# Altium schematic sheet LionIRVT-SV601272A-Bias.SchDoc: Bias Supply
size 431 x 279 mm; Date: Not shown in title block; ApprovedBy: Not shown in title block; CheckedBy: Not shown in title block; Author: Not shown in title block; CompanyName: Not shown in title block; Engineer: Not shown in title block; Organization: Not shown in title block; Address1: Not shown in title block; Address2: Not shown in title block; Address3: Not shown in title block; Address4: Not shown in title block; DocumentNumber: 3; Revision: Use project parameter SCH_Rev; SheetNumber: 3; SheetTotal: 11; PageSetup: Record=PageOptions|CenterHorizontal=True|CenterVertical=True|PrintScale=1.00|XCorrection=1.00|YCorrection=1.00|PrintKind=0|BorderSize=5000000|LeftOffset=0|BottomOffset=0|Orientation=2|PaperLength=1000|PaperWidth=1000|Scale=100|PaperSource=15|PrintQuality=600|MediaType=1|DitherType=10|PaperKind=Letter|PrintScaleMode=1; CurrentTime: Not shown in title block; CurrentDate: Not shown in title block; Time: Not shown in title block; DocumentFullPathAndName: Not shown in title block; DocumentName: Not shown in title block; ModifiedDate: Not shown in title block; ImagePath: Not shown in title block
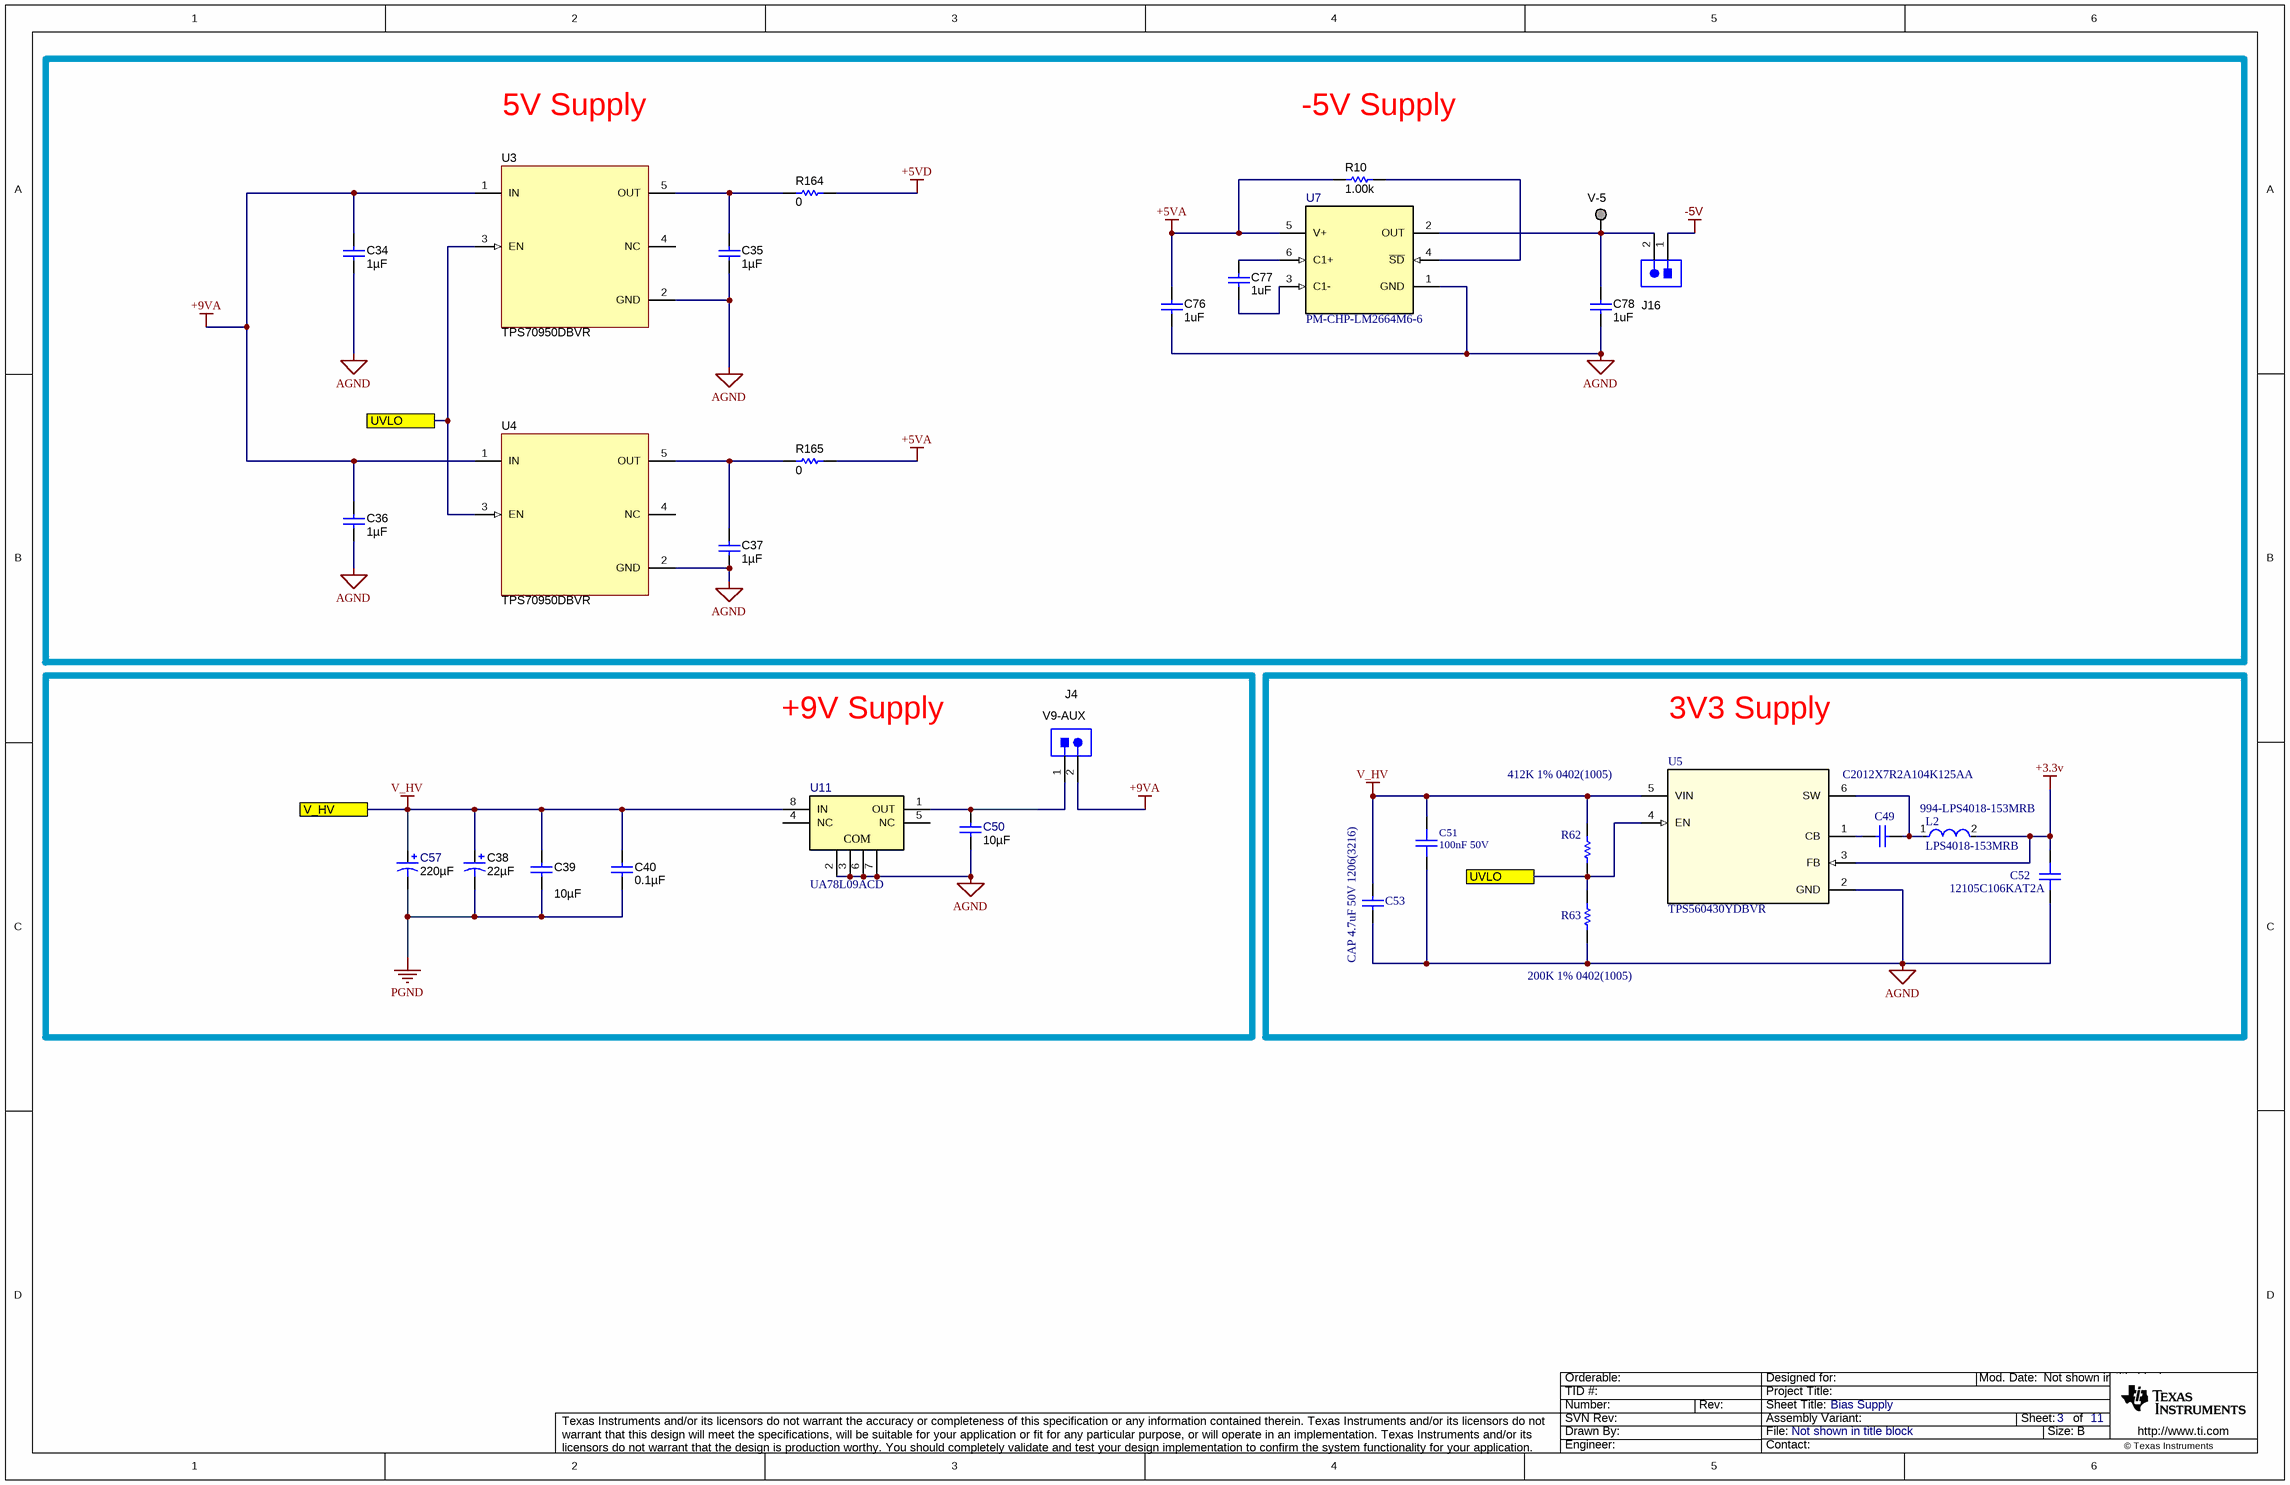
[diagram p0: LionIRVT-SV601272A-Bias.SchDoc]

## Parts
C34  ValueDisplayed: 1µF  [0805_HV]  (hidden comment: C2012X7S2A105K125AB)
C35  ValueDisplayed: 1µF  [0805_HV]  (hidden comment: C2012X7S2A105K125AB)
C36  ValueDisplayed: 1µF  [0805_HV]  (hidden comment: C2012X7S2A105K125AB)
C37  ValueDisplayed: 1µF  [0805_HV]  (hidden comment: C2012X7S2A105K125AB)
C38  ValueDisplayed: 22µF  [CAPSMT_62_JA0]  (hidden comment: EMVH101ADA220MJA0G)
C39  ValueDisplayed: 10µF  [2220_250]  (hidden comment: C5750X7S2A106M230KB)
C40  ValueDisplayed: 0.1µF  [0805_HV]  (hidden comment: C2012X7R2A104K125AA)
C49  C2012X7R2A104K125AA  [CAPC2013X145X20ML20]
C50  ValueDisplayed: 10µF  [0603C]  (hidden comment: GRM188R61E106MA73D)
C51  100nF 50V  [0603C]
C52  12105C106KAT2A  [1210M]
C53  CAP 4.7uF 50V 1206(3216)  [CAPC1206(3216)190_N]
C57  ValueDisplayed: 220µF  [SM_RADIAL_G]  (hidden comment: EEE-FC1E221P)
C76  ValueDisplayed: 1uF  [0805_HV]  (hidden comment: Capacitor)
C77  ValueDisplayed: 1uF  [0805_HV]  (hidden comment: Capacitor)
C78  ValueDisplayed: 1uF  [0805_HV]  (hidden comment: Capacitor)
J4  HTSW-102-07-G-S  [Samtec_HTSW-102-07-G-S]  (value not drawn)
J16  HTSW-102-07-G-S  [Samtec_HTSW-102-07-G-S]  (value not drawn)
L2  LPS4018-153MRB  Supplier Part Number 1: 994-LPS4018-153MRB  [FP-LPS4018-MFG]
R10  ValueDisplayed: 1.00k  [0603R]  (hidden comment: ERJ-3EKF1001V)
R62  412K 1% 0402(1005)  [RESC0402(1005)_L]
R63  200K 1% 0402(1005)  [RESC0402(1005)_L]
R164  value 0  [1206]  (hidden comment: ERJ-8ENF10R0V)
R165  value 0  [1206]  (hidden comment: ERJ-8ENF10R0V)
U3  TPS70950DBVR  [DBV0005A_N]
U4  TPS70950DBVR  [DBV0005A_N]
U5  TPS560430YDBVR  [DBV0006A_N]
U7  PM-CHP-LM2664M6-6  [DBV0006A_M]
U11  UA78L09ACD  [D0008A_N]
V-5  Pogo Pad  [PogoPad]  (value not drawn)  (no BOM)

## Blocks framed on the sheet
V9-AUX: C38-C40 C50 C57 J4 U11

## Ports
UVLO, V_HV

## Nets
+3.3v: C52.2 L2.2 U5.3(FB)
+5VA: C76.1 R10.1 R165.2 U7.5(V+)
+5VD: R164.2
+9VA: C34.1 C36.1 J4.2 U3.1(IN) U4.1(IN)
-5V: J16.1
AGND: C34.2 C35.2 C36.2 C37.2 C50.2 C51.1 C52.1 C53.1 C76.2 C78.2 R63.1 U3.2(GND) U4.2(GND) U5.2(GND) U7.1(GND) U11.2(GND) U11.3(GND) U11.6(GND) U11.7(GND)
PGND: C38.2(-) C39.2 C40.2 C57.2(-)
V_HV: C38.1(+) C39.1 C40.1 C51.2 C53.2 C57.1(+) R62.2 U5.5(VIN) U11.8(IN) ; port V_HV
UVLO: R62.1 R63.2 U3.3(EN) U4.3(EN) U5.4(EN) ; port UVLO
NetC35_1: C35.1 R164.1 U3.5(OUT)
NetC37_1: C37.1 R165.1 U4.5(OUT)
NetC49_1: C49.1 U5.1(CB)
NetC49_2: C49.2 L2.1 U5.6(SW)
NetC50_1: C50.1 J4.1 U11.1(OUT)
NetC77_1: C77.1 U7.6(C1+)
NetC77_2: C77.2 U7.3(C1-)
NetC78_1: C78.1 J16.2 U7.2(OUT) V-5.1
NetR10_2: R10.2 U7.4(~{SD})

Not connected (* = marked no-connect by the designer): U3 4(NC); U4 4(NC); U11 4(NC) 5(NC)

## Notes on the sheet
- 5V Supply
- -5V Supply
- +9V Supply
- 3V3 Supply
- Drawn By:
- SVN Rev:
- Number:
- TID #:
- Orderable:
- Rev:
- Sheet Title:
- File:
- Project Title:
- Designed for:
- Assembly Variant:
- Mod. Date:
- Sheet:
- Size:
- of
- B
- http://www.ti.com
- Texas Instruments and/or its licensors do not warrant the accuracy or completeness of this specification or any information contained therein. Texas Instruments and/or its licensors do not warrant that this design will meet the specifications, will be suitable for your application or fit for any particular purpose, or will operate in an implementation. Texas Instruments and/or its licensors do not warrant that the design is production worthy. You should completely validate and test your design implementation to confirm the system functionality for your application.
- Engineer:
- Contact:
- © Texas Instruments
- (in symbol UA78L09ACD) COM

## Library data of the parts
C34-C37 = C2012X7S2A105K125AB: CAP, CERM, 1 µF, 100 V, +/- 10%, X7S, 0805; Manufacturer: TDK; Polarized: N; CompType: Capacitor; Value: 1uF; U/M: EA; Cap_F: 0.000001; Tolerance_%: 10; Value1: Unknown; VDC_V: 100; Value2: 100V; TaMin_C: -55; TaMax_C: 125; Cap_Case: 0805; AEC Category: Q200; SymbolVersion: 2008-07-09; PartNumber: C2012X7S2A105K125AB; PackageReference: 0805; RoHS: Y; MountType: SMT; Technology: Ceramic; TempCo: X7S; Published: 2008-06-19; Publisher: Texas Instruments; LatestRevisionDate: 2015-12-07; ComponentLink1Description: Datasheet link; ComponentLink1URL: http://product.tdk.com/en/catalog/datasheets/mlcc_commercial_midvoltage_en.pdf; Supplier 1: Digi-Key; Supplier Part Number 1: 445-5205-1-ND; Supplier 2: Mouser; Supplier Part Number 2: 810-C2012X7S2A105K; Supplier 3: Farnell; Supplier Part Number 3: 2112709; AEC Qualified: N; AEC Grade: N/A
C38 = EMVH101ADA220MJA0G: CAP, AL, 22 µF, 100 V, +/- 20%, 0.55 ohm, SMD; Manufacturer: Chemi-Con; Polarized: Y; CompType: Capacitor; Value: 22uF; U/M: EA; Cap_F: 0.000022; Tolerance_%: 20; VDC_V: 100; Value2: 100V; ESR_ohm: 0.55; IRMS_A: 0.115; TaMin_C: -40; TaMax_C: 125; Cap_Case: JA0; SymbolVersion: 2008-07-09; PartNumber: EMVH101ADA220MJA0G; PackageReference: JA0; RoHS: Y; Value1: 0.55 ohm; MountType: SMT; Technology: AL; Series: MVH; Publisher: Texas Instruments; LatestRevisionDate: 2014-11-05; ComponentLink1Description: Datasheet link; ComponentLink1URL: http://www.chemi-con.co.jp/e/catalog/pdf/al-e/al-sepa-e/003-chip/al-mvh-e-111201.pdf; Supplier 1: Digi-Key; Supplier Part Number 1: 565-2341-1-ND; Supplier 2: Mouser; Supplier Part Number 2: 661-MVH100V220M; Supplier 3: Farnell; Supplier Part Number 3: 1698521
C39 = C5750X7S2A106M230KB: CAP, CERM, 10 µF, 100 V, +/- 20%, X7S,; Manufacturer: TDK; Polarized: N; CompType: Capacitor; Value: 10uF; U/M: EA; Cap_F: 0.00001; Tolerance_%: 20; ESR_ohm: 0.005; Value1: 0.005 ohm; VDC_V: 100; Value2: 100V; IRMS_A: 6.45; TaMin_C: -55; TaMax_C: 125; Cap_Case: 2220; SizeArea_mm2: 28.5; SizeAreaWB_mm2: 53.9; SizeX_mm: 5.7; SizeY_mm: 5; SizeZ_mm: 2.5; AEC Category: Q200; SymbolVersion: 2008-07-09; PartNumber: C5750X7S2A106M230KB; RoHS: Y; MountType: SMT; Technology: Ceramic; TempCo: X7S; Published: 2008-06-19; Publisher: Texas Instruments; LatestRevisionDate: 2016-08-21; ComponentLink1Description: Datasheet link; ComponentLink1URL: http://product.tdk.com/en/catalog/datasheets/mlcc_commercial_midvoltage_en.pdf; Supplier 1: Digi-Key; Supplier Part Number 1: 445-5212-1-ND; Supplier 2: Mouser; Supplier Part Number 2: 810-C5750X7S2A106M; Supplier 3: Farnell; Supplier Part Number 3: 2363568; AEC Qualified: N; AEC Grade: N/A
C40 = C2012X7R2A104K125AA: CAP, CERM, 0.1 µF, 100 V, +/- 10%, X7R, 0805; Manufacturer: TDK; Polarized: N; CompType: Capacitor; Value: 0.1uF; U/M: EA; Cap_F: 0.0000001; Tolerance_%: 10; ESR_ohm: 0.0158; Value1: 0.0158 ohm; VDC_V: 100; Value2: 100V; TaMin_C: -55; TaMax_C: 125; Cap_Case: 0805; AEC Category: Q200; SymbolVersion: 2008-07-09; PartNumber: C2012X7R2A104K125AA; PackageReference: 0805; RoHS: Y; MountType: SMT; Technology: Ceramic; TempCo: X7R; Published: 2008-06-19; Publisher: Texas Instruments; LatestRevisionDate: 2015-12-07; ComponentLink1Description: Datasheet link; ComponentLink1URL: http://www.tdk.co.jp/tefe02/e412_c.pdf; Supplier 1: Digi-Key; Supplier Part Number 1: 445-1418-1-ND; Supplier 2: Farnell; Supplier Part Number 2: 1844410; AEC Qualified: N; AEC Grade: N/A
C49 = CMP-2000-05453-1: Chip Capacitor, 100 nF, +/- 10%, 100 V, -55 to 1255 degC, 0805 (2012 Metric), RoHS, Tape and Reel; Manufacturer: TDK; PCN Part Number: MLCCPartNumberChange30/Nov/2012; Temperature Coefficient: X7R; Voltage - Rated: 100V; Kits: SAMPLEKIT1008-ND-KITCAPCERMLCC100V-630V; Other Names: 445-1418-1; Online Catalog: CSeries,MidVoltage; Featured Product: C-SeriesMidVoltageMLCCs; Catalog Drawings: CSERIES_2012-0805_1.45; Product Training Modules: HighCapacitanceReplacementSEAT,CCV,andTVCLDesignToolsGuidetoReplacinganElectrolyticCapacitorwithanMLCC; Capacitance: 0.1µF; Applications: GeneralPurpose; Datasheet Version: Jul-13; Mounting Type: SurfaceMount,MLCC; Height - Seated (Max): -; Packaging: CutTape(CT); Datasheet URL: https://datasheet.ciiva.com/11788/0900766b80fc5cba-11788142.pdf; Tolerance: ±10%; Package Reference: 805; Manufacturer URL: http://www.tdk.com/; Series: C; Lead Style: -; Operating Temperature: -55degC~125degC; Category: Capacitors; Package Description: 2-Pin Surface Mount Device, Body 2 x 1.25 mm; Standard Package: 1; Package / Case: 0805(2012Metric); Family: CeramicCapacitors; RoHS Information: RoHSCertificate-MLCC; Lead Spacing: -; Ratings: -; Features: -
C50 = GRM188R61E106MA73D: CAP, CERM, 10 µF, 25 V,+/- 20%, X5R, 0603; Manufacturer: MuRata; Polarized: N; CompType: Capacitor; Value: 10uF; U/M: EA; Cap_F: 0.00001; Tolerance_%: 20; VDC_V: 25; Value2: 25V; TaMin_C: -55; TaMax_C: 85; Cap_Case: 0603; SizeArea_mm2: 1.28; SizeAreaWB_mm2: 4.68; SizeX_mm: 1.6; SizeY_mm: 0.8; SizeZ_mm: 1; AEC Category: Q200; Green_Lifecycle: Active; Green_REACh: Passed; SymbolVersion: 2008-07-09; PartNumber: GRM188R61E106MA73D; PackageReference: 0603; RoHS: Y; MountType: SMT; Technology: Ceramic; TempCo: X5R; Published: 2008-06-19; Publisher: Texas Instruments; LatestRevisionDate: 2017-06-22; ComponentLink1Description: Datasheet link; ComponentLink1URL: http://psearch.murata.com/capacitor/product/GRM188R61E106MA73%23.pdf; Supplier 1: Digi-Key; Supplier Part Number 1: 490-7202-1-ND; Supplier 2: Mouser; Supplier Part Number 2: 81-GRM188R61E106MA3L; Supplier 3: Farnell; Supplier Part Number 3: 1828803RL; AEC Qualified: ?; Green_EU RoHS: Passed; Green_EU RoHS-2: Incomplete
C51 = gen_C_ceramic_100n_50V_X7R_0603: Ceramic, 100nF, ±10%, 50V, X7R, –55 to 125°C, 0603 (1608),RoHS, Automotive; Part Number: GCJ188R71H104KA12; Manufacturer: Murata; Capacitance: 100n; Case EIA: 0603; Case Metric: 1608; Automotive Qualified: True; PnP Package: C_0603_10; PnP Value: 100nF/50V/X7R; Dielectric: X7R; Rated Voltage: 50V; Height - Seated (Max): 0.8mm; Mounting Type: SurfaceMount,MLCC; Operating Temperature: –55 to 125°C; Series: GCJ; Tolerance: ±10%; Manufacturer_Part_Number: GCJ188R71H104KA12; Supplier 1: Digi-Key; Supplier Part Number 1: 490-5798-1-ND
C52 = gen_C_ceramic_10u_50V_X7R_1210: Ceramic, 10uF, 50 V, -55 to 125 degC, 2-Pin SMD (1210), RoHS, Tape and Reel; Manufacturer: AVX; Manufacturer 1: Kyocera AVX; Dielectric: X7R; Tolerance: ±10%; Load Life: 1000h; Type: CommercialSurfaceMountChip; Voltage Rating: 50V; Temperature Coefficient / Code: +/-15%; Case EIA: 1210; Case Metric: 3225; PnP Package: C_1210_10; PnP Value: 10µF/25V/X7R; Rated Voltage: 25V; Maximum Operating Temperature: +125C; Mounting Technology: SurfaceMount; Case Code - in: 1210; Package Description: 2-Pin Surface Mount Device, Body 3.2 x 2.5 mm; Datasheet URL: http://www.farnell.com/datasheets/1818074.pdf; Case Code - mm: 3225; Package / Case: 1210(3225metric); Product: GeneralTypeMLCCs; Capacitance: 10uF; Product Category: MultilayerCeramicCapacitorsMLCC-SMD/SMT; Minimum Operating Temperature: -55C; Manufacturer URL: http://www.avx.com/; Operating Temperature Range: -55Cto+125C; Termination Style: SMD/SMT; Factory Pack Quantity: 1000; RoHS: Details; Brand: AVX; Datasheet Version: 03/2014; Package Reference: 1210; Packaging: Reel; Voltage Rating DC: 50V; Height - Seated (Max): 2.5mm; Mounting Type: SurfaceMount,MLCC; Operating Temperature: –55 to 125°C; Series: GCM; Manufacturer Part Number 1: 12105C106KAT2A
C53 = CMP-1037-04923-1: CAP 4.7uF 50V ±10% 1206 (3216 Metric) Thickness 1.9mm SMD; Case-EIA: 1206; Case-Metric: 3216; Tolerance: Â±10%; Technology: SMT; Rated Voltage: 50 V; Max Thickness: 1.9 mm; Value: 4.7uF
C57 = EEE-FC1E221P: CAP, AL, 220 µF, 25 V, +/- 20%, 0.15 ohm, SMD; Manufacturer: Panasonic; Polarized: Y; CompType: Capacitor; Value: 220uF; U/M: EA; Cap_F: 0.00022; Tolerance_%: 20; VDC_V: 25; Value2: 25V; ESR_ohm: 0.15; IRMS_A: 0.67; TaMin_C: -40; TaMax_C: 105; Cap_Case: G; SizeAreaWB_mm2: 172.2; SizeArea_mm2: 123.6; SizeX_mm: 12; SizeY_mm: 10.3; SizeZ_mm: 10.2; AEC Category: Q200; SymbolVersion: 2008-07-09; PartNumber: EEE-FC1E221P; PackageReference: SMT Radial G; RoHS: Y; Value1: 0.15 ohm; MountType: SMT; Technology: AL; Series: FC; Publisher: Texas Instruments; LatestRevisionDate: 2017-03-23; ComponentLink1Description: Datasheet link; ComponentLink1URL: http://www.panasonic.com/industrial/components/pdf/smt_aec_050505.pdf; Supplier 1: Digi-Key; Supplier Part Number 1: PCE4005CT-ND; Supplier 2: Mouser; Supplier Part Number 2: 667-EEE-FC1E221P; Supplier 3: Farnell; Supplier Part Number 3: 1244363; AEC Qualified: ?
C76-C78 = CMP-0007891-2: CAP, CERM, 1 uF, 100 V, +/- 10%, X7S, 0805; PartNumber: C2012X7S2A105K125AB; Manufacturer: TDK; Polarized: N; Value: 1uF; U/M: EA; Cap_F: 1µF; ESR_ohm: 8.255m; Value1: 0.008255 ohm; VDC_V: 100V; IRMS_A: 2.27442A; TaMin_C: -55°C; TaMax_C: 125°C; Cap_Case: 0805; AEC Category: Q200; SizeArea_mm2: 2.5; SizeAreaWB_mm2: 6.75; SizeX_mm: 2; SizeY_mm: 1.25; SizeZ_mm: 1.45; CompType: Capacitor; PackageReference: 0805; RoHS: Y; Tolerance_%: 10%; Value2: 100V; MountType: SMT; Technology: Ceramic; TempCo: X7S; Published: 2008-06-19; Publisher: Texas Instruments; LatestRevisionDate: 2017-03-09; ComponentLink1Description: Datasheet link; ComponentLink1URL: https://product.tdk.com/en/search/capacitor/ceramic/mlcc/info?part_no=C2012X7S2A105K125AB; Supplier 1: Digi-Key; Supplier Part Number 1: 445-5205-1-ND; Supplier 2: Newark; Supplier Part Number 2: 90R8332; Supplier 3: Mouser; Supplier Part Number 3: 810-C2012X7S2A105K; AEC Qualified: N; AEC Grade: N/A
J4 J16 = HTSW-102-07-G-S: Header, 100mil, 2x1, Gold, TH; Manufacturer: Samtec; SymbolCreator: a0412235; U/M: EA; SymbolVersion: 2013-10-31; PartNumber: HTSW-102-07-G-S; ClassName: Header; PackageReference: Header, 100mil, 2x1, TH; CompType: Header; RoHS: Y; MountType: TH; ComponentLink1Description: Datasheet Link; ComponentLink1URL: http://www.samtec.com/ftppub/pdf/TSW_TH.PDF; Publisher: Texas Instruments; Supplier 1: Digi-Key; Supplier Part Number 1: SAM8736-ND
  J4: LatestRevisionDate: 2014-12-19
  J16: LatestRevisionDate: 2015-09-29
L2 = CMP-11268-000004-1: Power inductor, shielded, 20/30% tol, SMT, RoHS, lead-free, halogen-free; Manufacturer Part Number: LPS4018-223MRB; Manufacturer: Coilcraft; Inductance: 22uH; Series Resistance: 0.36Ω; Test Frequency: 1MHz; Self Resonant Frequency: 26MHz; Tolerance: 20%; Core Material: Ferrite; Value: 22uH; Automotive Grade: Grade 3; Rms Current: 0.9A; Saturation Current: 0.8A; Shielding: true; DC Resistance (DCR): 260mR; Max DC Current: 940mA; RMS Current (Irms): 800mA; RoHS: TRUE; Device Class L3: Fixed Inductors; Category: Ind; Lead Free: Yes; ComponentLink2URL: https://www.coilcraft.com/pdfs/lps4018.pdf; Height: 1.8mm; Mouser Description: Power inductor, shielded, 20/30% tol, SMT, RoHS, lead-free, halogen-free; Ambient Temperature Range High: +85°C; Ambient Temperature Range Low: -40°C; Device Class L2: Inductors; Package: LPS4018; Device Class L1: Passive Components; Octopart: https://octopart.com/lps4018-223mrb-coilcraft-30061092; ComponentLink2Description: Datasheet; Automotive: Yes; Supplier 1: Mouser; Stock 1: 5661; Pricing 1: 1=1.08000, 10=0.90400, 50=0.89000, 100=0.89000, 200=0.89000, 500=0.61200 (USD); Weight: 0.003527oz; Min Operating Temperature: -40°C; Max Operating Temperature: 85°C; Packaging: Cut Tape; Termination: SMD/SMT; Inductance Tolerance: 20%; Package Quantity: 1; Length: 4mm; Width: 4mm; REACH SVHC: No SVHC; ComponentLink1URL: https://datasheet.ciiva.com/46449/1805324-46449067.pdf?src-supplier=Element14; ComponentLink1Description: https://datasheet.ciiva.com/46449/1805324-46449067.pdf?src-supplier=Element14; ComponentLink3URL: https://datasheet.ciiva.com/46384/1805324-46384172.pdf?src-supplier=Element14; ComponentLink3Description: https://datasheet.ciiva.com/46384/1805324-46384172.pdf?src-supplier=Element14
R10 = CMP-0022680-4: RES, 1.00 k, 1%, 0.1 W, 0603; Manufacturer: Panasonic; Power_W: 100mW; TempCo: 100 ppm/C; Value_Code: 1k00; U/M: EA; Value: 1.00k; EIA_Code: E96; Res_ohm: 1k; SizeX_mm: 1.6; SizeY_mm: 0.8; SizeZ_mm: 1; SizeArea_mm2: 1.28; CompType: Resistor; VDC_V: 75V; AEC Category: Q200; Value2: 0.1W; Supplier Part Number 2: 90W3099; Publisher: Texas Instruments; Supplier 2: Newark; Supplier Part Number 3: 667-ERJ-3EKF1001V; Supplier 3: Mouser; Published: 2008-06-26; RoHS: Y; Value1: 1%; MountType: SMT; Supplier 1: Digi-Key; PackageReference: 0603; Tolerance_%: 1%; LatestRevisionDate: 2017-03-09; PartNumber: ERJ-3EKF1001V; AEC Qualified: ?; ComponentLink1Description: Datasheet link; Supplier Part Number 1: P1.00KHCT-ND; Technology: Thick Film; ComponentLink1URL: http://industrial.panasonic.com/www-data/pdf/AOA0000/AOA0000CE2.pdf
R62 = CMP-1011-00805-1: 412K 0.063W 1% 0402 (1005 Metric)  SMD; Case-EIA: 0402; Case-Metric: 1005; Value: 412000.00 Ohm; Tolerance: 1 %; Technology: SMT; Power: 0.063 W
R63 = CMP-1011-00768-1: 200K 0.063W 1% 0402 (1005 Metric)  SMD; Value: 200000.00 Ohm; Case-Metric: 1005; Case-EIA: 0402; Tolerance: 1 %; Power: 0.063 W; Technology: SMT
R164 R165 = ERJ-8ENF10R0V: RES, 10.0, 1%, 0.25 W, 1206; Manufacturer: Panasonic; CompType: Resistor; Res_ohm: 10; Value_Code: 10R0; Tolerance_%: 1; Power_W: 0.25; Value2: 0.25W; VDC_V: 200; TempCo: 100 ppm/C; EIA_Code: E96; U/M: EA; ValueDisplayed: 10.0; SymbolVersion: 2009-05-29; PartNumber: ERJ-8ENF10R0V; PackageReference: 1206; RoHS: Y; Value1: 1%; MountType: SMT; Technology: Thick Film; Published: 2008-06-26; Publisher: Texas Instruments; LatestRevisionDate: 2014-09-18; ComponentLink1Description: Datasheet link; ComponentLink1URL: http://www.panasonic.com/industrial/components/pdf/AOA0000CE2.pdf; Supplier 1: Digi-Key; Supplier Part Number 1: P10.0FCT-ND; Supplier 2: Farnell; Supplier Part Number 2: 1748406
U3 U4 = TPS70950DBVR: 150-mA, 30-V, 1-uA IQ Voltage Regulators with Enable, DBV0005A; Alternate PartNumber: TPS70950DBVT; Manufacturer: Texas Instruments; SymbolCreator: Altium; CompType: IC; U/M: EA; SymbolVersion: 2014-08-29; PartNumber: TPS70950DBVR; PackageReference: DBV0005A; MountType: SMT; ComponentLink1Description: Datasheet Link; ComponentLink1URL: http://www.ti.com/lit/ds/symlink/tps70950.pdf; RoHS: Y; Publisher: Texas Instruments; LatestRevisionDate: 2014-11-26; Alternate Manufacturer: Texas Instruments
U5 = TPS560430YDBVR: Imported; Manufacturer: Texas Instruments; PartNumber: TPS560430YDBVR; RefDes: RefDes; TYPE: TYPE; Value: Value
U7 = CMP-0072146-1: Switched Capacitor Voltage Converter, 6-pin SOT-23; Manufacturer: Texas Instruments; PackageTopMarking: S03A*XTT; PowerWise: N; CompType: Switch Caps; PackageReference: DBV0006A; PackageDescription: Molded SOT-23, .115 x .063 x .040in Body, 6 Lead, .0375in in Pitch; RoHS: N; PinCount: 6; Code_JEDEC: MO-178-AB; Code_IPC: SOT26A-6; ComponentLink1Description: Datasheet URL; ComponentLink1URL: http://www.ti.com/general/docs/lit/getliterature.tsp?genericPartNumber=LM2664&fileType=pdf
U11 = UA78L09ACD: Fixed Regulator with 11.5 to 24 V Input and 9 V Output, 0 to 125 degC, 8-Pin SOIC (D), Green (RoHS & no Sb/Br); Manufacturer: Texas Instruments; Alternate PartNumber: Equivalent; Iout(Max)(A): 0.1; Iq(Typ)(mA): 6; Vin(Max)(V): 24; Vin(Min)(V): 11.5; Vout(Max)(V): 9; Vdo(Typ)(V): 1.7; DatasheetVersion: SLVS010S; PackageVersion: revM, Jun-2011; PackageReference: D0008A; PackageDescription: 8-Pin Plastic Small Outline Integrated Circuit, 4.9 x 3.9 mm, Pitch 1.27 mm Pitch; Supplier 1: Digi-Key; Supplier Part Number 1: 296-11126-5-ND; Supplier 2: Newark; Supplier Part Number 2: 77C1871; Supplier 3: Mouser; Supplier Part Number 3: 595-UA78L09ACD; Eco-Plan: Green (RoHS & no Sb/Br); Vout(Min)(V): 9; MountType: SMT; PartNumber: UA78L09ACD; Code_JEDEC: MS-012AA; ComponentLink1Description: Datasheet; ComponentLink1URL: http://www.ti.com/general/docs/lit/getliterature.tsp?genericPartNumber=UA78L09A&fileType=pdf; ComponentLink2Description: URL Link1; ComponentLink2URL: Samples URL:http://www.ti.com/product/ua78l09a#samples; Alternate Manufacturer: Texas Instruments
V-5 = PogoPad: Pad for Pogo Pin Connector; SymbolCreator: codlsc; SymbolVersion: 2010-09-27; PackageReference: N/A; CompType: Pogo Pad; Publisher: Texas Instruments; LatestRevisionDate: 2016-12-05; LatestRevisionNote: Added Alternate PartNumber and Alternate Manufacturer parameters to appropriate components.